# Altium schematic sheet 10 ARDUINO_JTAG.SchDoc
size 513 x 386 mm
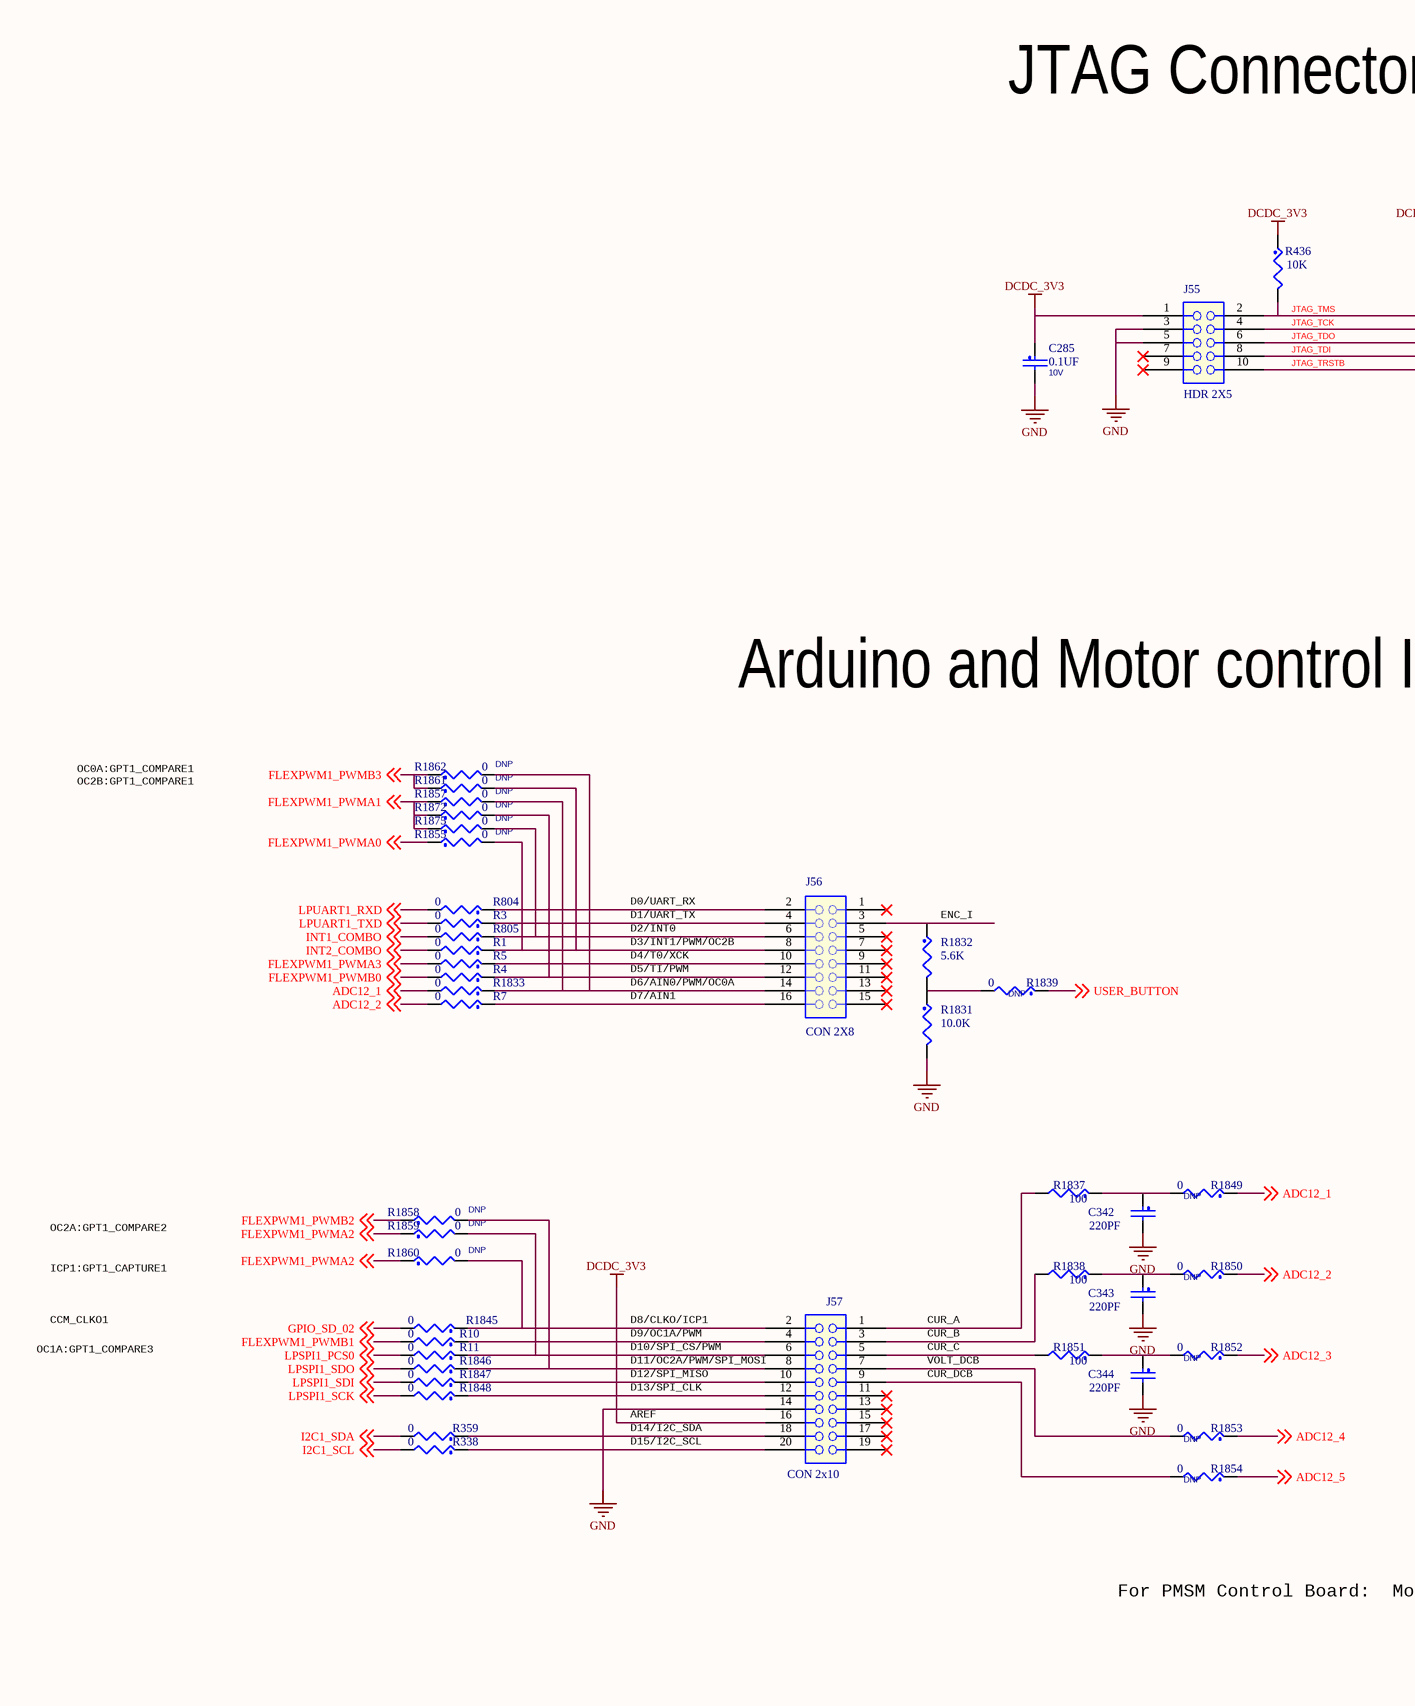
[diagram p0: 10 ARDUINO_JTAG.SchDoc, left]
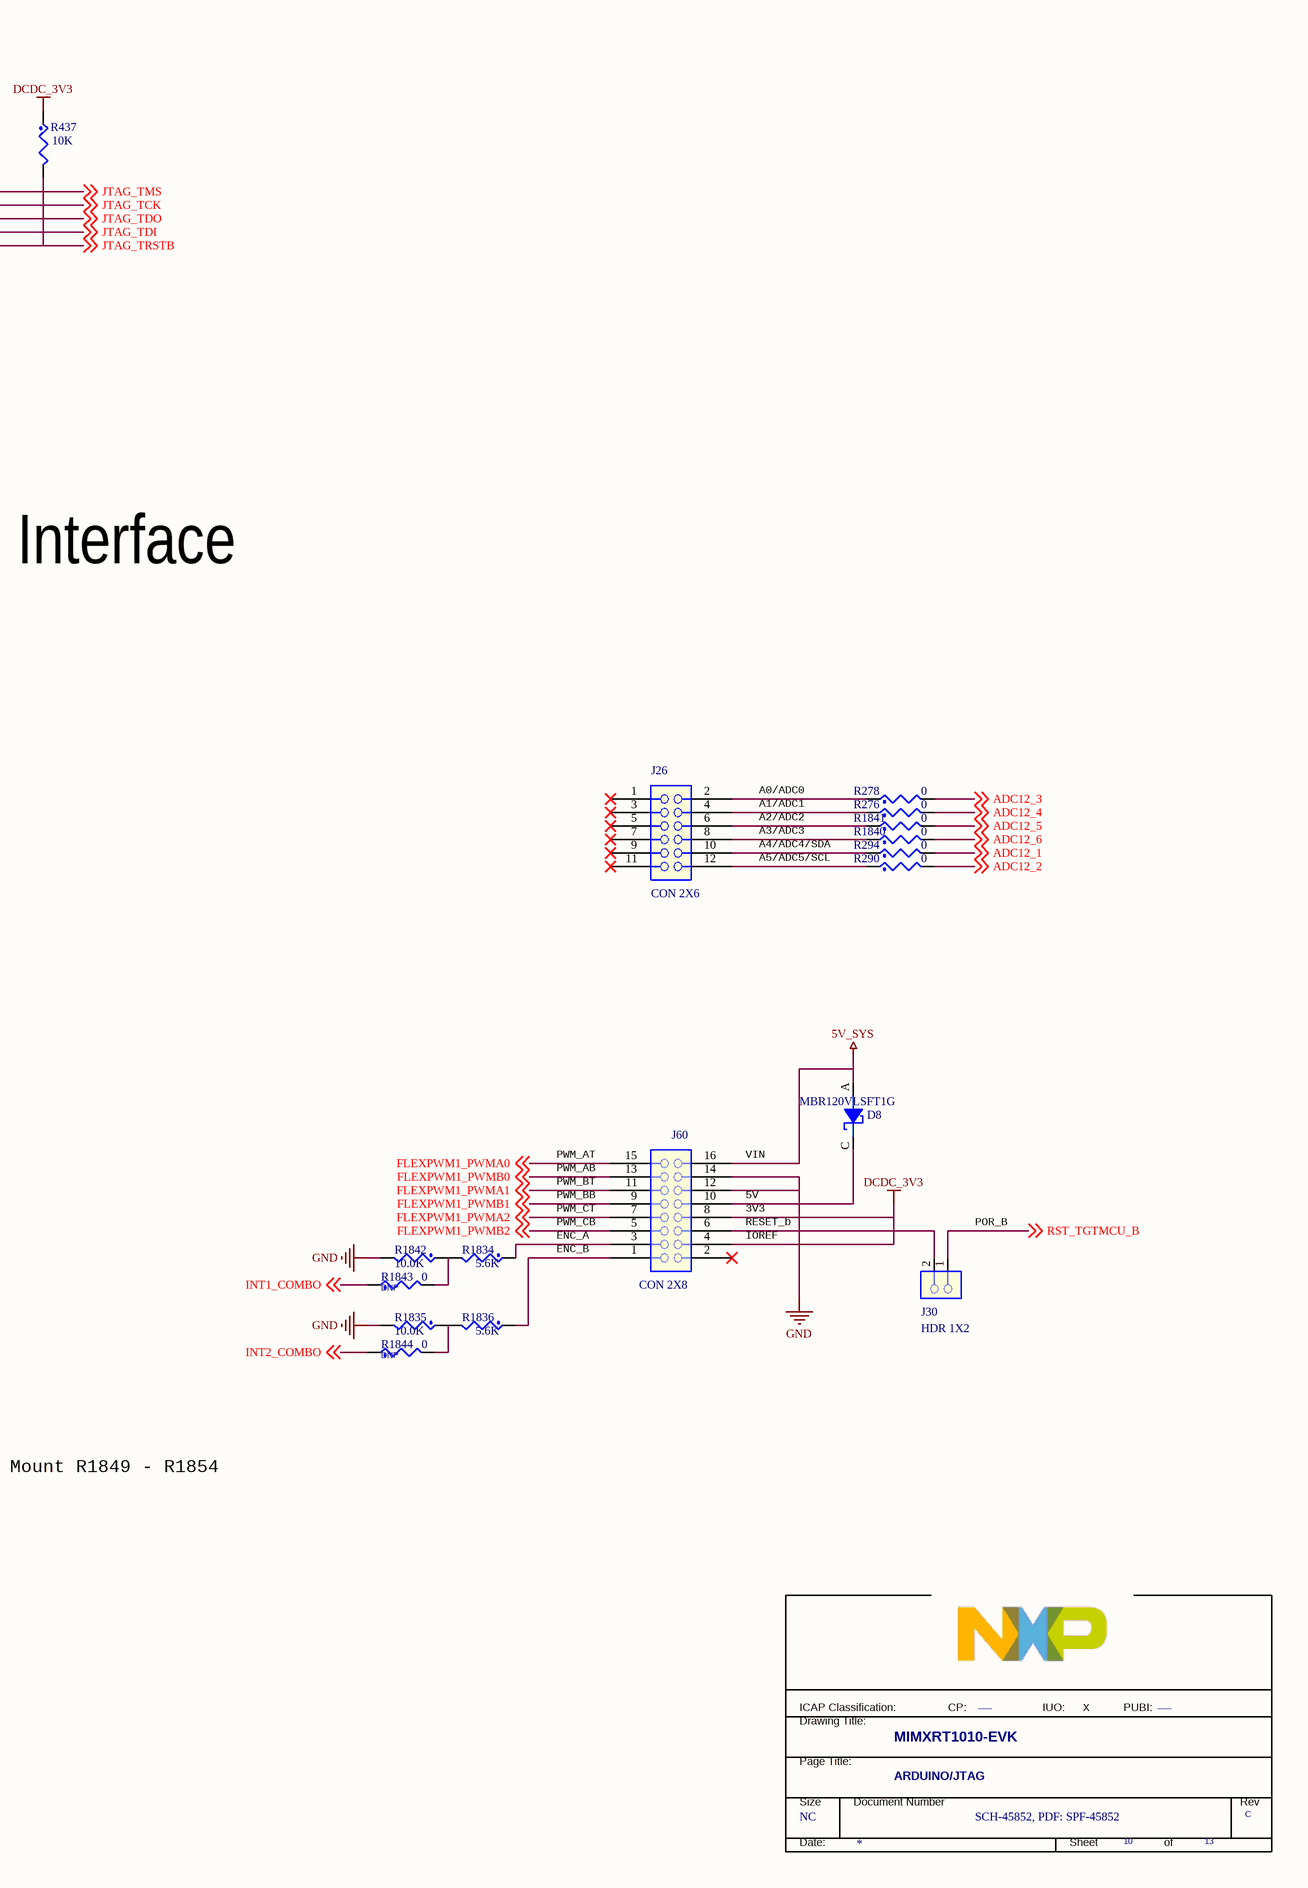
[diagram p1: 10 ARDUINO_JTAG.SchDoc, right]

## Parts
*  PUBI: ___  Doc: SCH-45852, PDF: SPF-45852  RevCode: C  Title: MIMXRT1010-EVK  Page Size: NC  Page Number: 10  Page Count: 13  PageTitle: ARDUINO/JTAG  (hidden comment: TitleBlock_FS)  (graphical)
C285  0.1UF  VOLTAGE: 10V  [CC0402_25]
C342  220PF  [CC0402_25]
C343  220PF  [CC0402_25]
C344  220PF  [CC0402_25]
D8  MBR120VLSFT1G  [SOD-123]
J26  CON 2X6  [con_skt2x6_th]
J30  HDR 1X2  [HDR102]
J55  HDR 2X5  [hdr205_50_th]
J56  CON 2X8  [con_2x8_skt_100_th]
J57  CON 2x10  [con_skt2x10_th]
J60  CON 2X8  [con_2x8_skt_100_th]
R1  0  [0402_CC]
R3  0  [0402_CC]
R4  0  [0402_CC]
R5  0  [0402_CC]
R7  0  [0402_CC]
R10  0  [0402_CC]
R11  0  [0402_CC]
R276  0  [0402_CC]
R278  0  [0402_CC]
R290  0  [0402_CC]
R294  0  [0402_CC]
R338  0  [0402_CC]
R359  0  [0402_CC]
R436  10K  [0402_CC]
R437  10K  [0402_CC]
R804  0  [0402_CC]
R805  0  [0402_CC]
R1831  10.0K  [RC0402_25]
R1832  5.6K  [RC0402_25]
R1833  0  [0402_CC]
R1834  5.6K  [RC0402_25]
R1835  10.0K  [RC0402_25]
R1836  5.6K  [RC0402_25]
R1837  100  [RC0402_25]
R1838  100  [RC0402_25]
R1839  0  ASSY_OPT: DNP  [0402_CC]
R1840  0  [0402_CC]
R1841  0  [0402_CC]
R1842  10.0K  [RC0402_25]
R1843  0  ASSY_OPT: DNP  [0402_CC]
R1844  0  ASSY_OPT: DNP  [0402_CC]
R1845  0  [0402_CC]
R1846  0  [0402_CC]
R1847  0  [0402_CC]
R1848  0  [0402_CC]
R1849  0  ASSY_OPT: DNP  [0402_CC]
R1850  0  ASSY_OPT: DNP  [0402_CC]
R1851  100  [RC0402_25]
R1852  0  ASSY_OPT: DNP  [0402_CC]
R1853  0  ASSY_OPT: DNP  [0402_CC]
R1854  0  ASSY_OPT: DNP  [0402_CC]
R1855  0  ASSY_OPT: DNP  [0402_CC]
R1857  0  ASSY_OPT: DNP  [0402_CC]
R1858  0  ASSY_OPT: DNP  [0402_CC]
R1859  0  ASSY_OPT: DNP  [0402_CC]
R1860  0  ASSY_OPT: DNP  [0402_CC]
R1861  0  ASSY_OPT: DNP  [0402_CC]
R1862  0  ASSY_OPT: DNP  [0402_CC]
R1872  0  ASSY_OPT: DNP  [0402_CC]
R1875  0  ASSY_OPT: DNP  [0402_CC]

## Nets
5V_SYS: D8.A J60.16(B8)
DCDC_3V3: C285.1 J55.1(A1) J57.16 J60.4(B2) J60.8(B4) R436.1 R437.1
GND: C285.2 C342.2 C343.2 C344.2 J55.3(A2) J55.5(A3) J57.14 J60.12(B6) J60.14(B7) R1831.2 R1835.2 R1842.2
ADC12_1: R294.2 R1833.2 R1849.1 ; off-sheet ADC12_1
ADC12_2: R7.2 R290.2 R1850.1 ; off-sheet ADC12_2
ADC12_3: R278.2 R1852.1 ; off-sheet ADC12_3
ADC12_4: R276.2 R1853.1 ; off-sheet ADC12_4
ADC12_5: R1841.2 R1854.1 ; off-sheet ADC12_5
ADC12_6: R1840.2 ; off-sheet ADC12_6
FLEXPWM1_PWMA0: J60.15(A8) R1855.1 ; off-sheet FLEXPWM1_PWMA0
FLEXPWM1_PWMA1: J60.11(A6) R1857.1 R1872.1 R1875.1 ; off-sheet FLEXPWM1_PWMA1
FLEXPWM1_PWMA2: J60.7(A4) R1859.1 R1860.1 ; off-sheet FLEXPWM1_PWMA2
FLEXPWM1_PWMA3: R5.2 ; off-sheet FLEXPWM1_PWMA3
FLEXPWM1_PWMB0: J60.13(A7) R4.2 ; off-sheet FLEXPWM1_PWMB0
FLEXPWM1_PWMB1: J60.9(A5) R10.2 ; off-sheet FLEXPWM1_PWMB1
FLEXPWM1_PWMB2: J60.5(A3) R1858.1 ; off-sheet FLEXPWM1_PWMB2
FLEXPWM1_PWMB3: R1861.1 R1862.1 ; off-sheet FLEXPWM1_PWMB3
GPIO_SD_02: R1845.2 ; off-sheet GPIO_SD_02
I2C1_SCL: R338.2 ; off-sheet I2C1_SCL
I2C1_SDA: R359.2 ; off-sheet I2C1_SDA
INT1_COMBO: R805.2 R1843.1 ; off-sheet INT1_COMBO
INT2_COMBO: R1.2 R1844.1 ; off-sheet INT2_COMBO
JTAG_TCK: J55.4(B2) ; off-sheet JTAG_TCK
JTAG_TDI: J55.8(B4) ; off-sheet JTAG_TDI
JTAG_TDO: J55.6(B3) ; off-sheet JTAG_TDO
JTAG_TMS: J55.2(B1) R436.2 ; off-sheet JTAG_TMS
JTAG_TRSTB: J55.10(B5) R437.2 ; off-sheet JTAG_TRSTB
LPSPI1_PCS0: R11.2 ; off-sheet LPSPI1_PCS0
LPSPI1_SCK: R1848.2 ; off-sheet LPSPI1_SCK
LPSPI1_SDI: R1847.2 ; off-sheet LPSPI1_SDI
LPSPI1_SDO: R1846.2 ; off-sheet LPSPI1_SDO
LPUART1_RXD: R804.2 ; off-sheet LPUART1_RXD
LPUART1_TXD: R3.2 ; off-sheet LPUART1_TXD
RST_TGTMCU_B: J30.1 ; off-sheet RST_TGTMCU_B
USER_BUTTON: R1839.1 ; off-sheet USER_BUTTON
NetC342_1: C342.1 R1837.1 R1849.2
NetC343_1: C343.1 R1838.1 R1850.2
NetC344_1: C344.1 R1851.1 R1852.2
NetD8_C: D8.C J60.10(B5)
NetJ26_2: J26.2(B1) R278.1
NetJ26_4: J26.4(B2) R276.1
NetJ26_6: J26.6(B3) R1841.1
NetJ26_8: J26.8(B4) R1840.1
NetJ26_10: J26.10(B5) R294.1
NetJ26_12: J26.12(B6) R290.1
NetJ30_2: J30.2 J60.6(B3)
NetJ56_2: J56.2(B1) R804.1
NetJ56_3: J56.3(A2) R1832.1
NetJ56_4: J56.4(B2) R3.1
NetJ56_6: J56.6(B3) R805.1 R1875.2
NetJ56_8: J56.8(B4) R1.1 R1855.2 R1861.2
NetJ56_10: J56.10(B5) R5.1
NetJ56_12: J56.12(B6) R4.1 R1872.2
NetJ56_14: J56.14(B7) R1833.1 R1857.2 R1862.2
NetJ56_16: J56.16(B8) R7.1
NetJ57_1: J57.1 R1837.2
NetJ57_2: J57.2 R1845.1 R1860.2
NetJ57_3: J57.3 R1838.2
NetJ57_4: J57.4 R10.1
NetJ57_5: J57.5 R1851.2
NetJ57_6: J57.6 R11.1 R1859.2
NetJ57_7: J57.7 R1853.2
NetJ57_8: J57.8 R1846.1 R1858.2
NetJ57_9: J57.9 R1854.2
NetJ57_10: J57.10 R1847.1
NetJ57_12: J57.12 R1848.1
NetJ57_18: J57.18 R359.1
NetJ57_20: J57.20 R338.1
NetJ60_1: J60.1(A1) R1836.1
NetJ60_3: J60.3(A2) R1834.1
NetR1831_1: R1831.1 R1832.2 R1839.2
NetR1834_2: R1834.2 R1842.1 R1843.2
NetR1835_1: R1835.1 R1836.2 R1844.2

Not connected (* = marked no-connect by the designer): J26 1(A1)* 3(A2)* 5(A3)* 7(A4)* 9(A5)* 11(A6)*; J55 7(A4)* 9(A5)*; J56 1(A1)* 5(A3)* 7(A4)* 9(A5)* 11(A6)* 13(A7)* 15(A8)*; J57 11* 13* 15* 17* 19*; J60 2(B1)*

## Notes on the sheet
- JTAG Connector
- Arduino and Motor control Interface
- OC0A:GPT1_COMPARE1
  OC2B:GPT1_COMPARE1
- D1/UART_TX
- D2/INT0
- D0/UART_RX
- (near R1832) ENC_I
- A0/ADC0
- A1/ADC1
- D7/AIN1
- D4/T0/XCK
- D5/TI/PWM
- D6/AIN0/PWM/OC0A
- D3/INT1/PWM/OC2B
- A3/ADC3
- A2/ADC2
- A4/ADC4/SDA
- A5/ADC5/SCL
- OC2A:GPT1_COMPARE2
- ICP1:GPT1_CAPTURE1
- OC1A:GPT1_COMPARE3
- CCM_CLKO1
- D8/CLKO/ICP1
- D9/OC1A/PWM
- CUR_B
- CUR_A
- PWM_AT
- PWM_AB
- PWM_CT
- PWM_BT
- PWM_BB
- 3V3
- 5V
- VIN
- D10/SPI_CS/PWM
- D12/SPI_MISO
- D11/OC2A/PWM/SPI_MOSI
- D13/SPI_CLK
- CUR_C
- CUR_DCB
- VOLT_DCB
- ENC_A
- ENC_B
- PWM_CB
- RESET_b
- IOREF
- (near J30) POR_B
- D15/I2C_SCL
- D14/I2C_SDA
- AREF
- For PMSM Control Board:  Mount R1849 - R1854
- X
- (in symbol TitleBlock_FS) ICAP Classification:; CP:; IUO:; PUBI:; Drawing Title:; Page Title:; Size; Document Number; Rev; Date:; Sheet; of

## Library data of the parts
* = TitleBlock_FS: FIUO: _X_; OrgAddr2: Austin, TX 78735-8598; OrgAddr1: 6501 William Cannon Drive West; OrgName: Freescale Semiconductor; FCP: ___; Page Create Date: March  8, 1995; Page Modify Date: *
C285 = CAP_NP: CAP CER 0.1UF 10V 10% X5R 0402; CLASS: DISCRETE; FPLIST: CC0402_25,CC0402_HD,0402_CC; CAD_APPROVED: Yes; MFG_PN01: CC0402KRX5R6BB104; MFG_NAME01: YAGEO AMERICA; AGILE_PN: 150-75634; PCB Footprint: CC0402_25; HEIGHT: 0.64MM; ROHS: Yes; Tolerance: 10%
C342-C344 = CAP_NP: CAP CER 220PF 50V 10% X7R 0402; CLASS: DISCRETE; AGILE_PN: 150-75829; MFG_NAME01: KEMET; MFG_PN01: C0402C221K5RAC; CAD_APPROVED: Yes; FPLIST: CC0402_25,CC0402_HD,0402_CC; Tolerance: 10%; ROHS: Yes; HEIGHT: 0.55MM; VOLTAGE: 50V; PCB Footprint: CC0402_25
D8 = DIODE_SCHTKY_Dup1: DIODE SCH RECT 1A 20V SMT; CLASS: IC; AGILE_PN: 480-75997; MFG_NAME01: ON SEMICONDUCTOR; CAD_APPROVED: Yes; MFG_PN01: MBR120VLSFT1G; ROHS: Yes; HEIGHT: 1MM; PCB Footprint: SOD-123
J26 = CONN_HDR_6X2: CON 2X6 SKT SHRD TH 100MIL CTR 345H AU 126L; CLASS: IO; AGILE_PN: 210-81774; MFG_NAME01: ANYTRONIC CORPORATION LIMITED; MFG_PN01: 08010S31211-29RF; Temp_Range: -40 to +105C; CAD_APPROVED: Yes; PCB Footprint: con_skt2x6_th; ROHS: Yes; HEIGHT: 8.75MM
J30 = CONN_HDR_2X1: HDR 1X2 TH 100MIL SP 339H AU 98L; CLASS: IO; AGILE_PN: 210-81490; MFG_NAME01: ANYTRONIC CORPORATION LIMITED; MFG_PN01: 0901S0202011N9T-31RF; Temp_Range: -55¡ãC to +105¡ãC; CAD_APPROVED: Yes; ROHS: Yes; HEIGHT: 8.59MM; PCB Footprint: HDR102
J55 = CONN_HDR_5X2: HDR 2X5 TH 50MIL CTR 172H AU 91L; CLASS: IO; AGILE_PN: 210-81466; MFG_NAME01: ANYTRONIC CORPORATION LIMITED; MFG_PN01: 0922S0205011N9T-31RF; Temp_Range: -55DegC to +105DegC; CAD_APPROVED: Yes; PCB Footprint: hdr205_50_th; ROHS: Yes; HEIGHT: 4.38MM
J56 J60 = CONN_HDR_8X2: CON 2X8 SKT SHRD TH 100MIL CTR 345H AU 126L; CLASS: IO; AGILE_PN: 210-81775; MFG_NAME01: ANYTRONIC CORPORATION LIMITED; MFG_PN01: 08010S31611-29RF; Temp_Range: -40 to +105C; CAD_APPROVED: Yes; PCB Footprint: con_2x8_skt_100_th; ROHS: Yes; HEIGHT: 8.75MM
J57 = CONN_HDR_10X2: CON 2X10 SKT SHRD TH 100MIL CTR 345H AU 126L; CLASS: IO; CAD_APPROVED: Yes; Temp_Range: -40 to +105C; MFG_PN01: 08010S32011-29RF; MFG_NAME01: ANYTRONIC CORPORATION LIMITED; AGILE_PN: 210-81776; PCB Footprint: con_skt2x10_th; HEIGHT: 8.75MM; ROHS: Yes
R1 R4 R5 R7 R11 R294 R359 R1833 R1839 R1841 R1845 R1847 R1854 R1855 R1857-R1859 R1861 R1872 R1875 = RES_Dup1: RES MF ZERO OHM 1/16W 5% 0402; CLASS: DISCRETE; FPLIST: RC0402_25,RC0402_HD,RC0402_X2,0402_CC; CAD_APPROVED: Yes; MFG_PN01: MCR01MZPJ000; MFG_NAME01: ROHM; AGILE_PN: 470-75394; PCB Footprint: 0402_CC; ROHS: Yes; Tolerance: 5%; HEIGHT: 0.45 MM
R3 R10 R276 R278 R290 R338 R804 R805 R1840 R1843 R1844 R1846 R1848-R1850 R1852 R1853 R1860 R1862 = RES_Dup1: RES MF ZERO OHM 1/16W 5% 0402; CLASS: DISCRETE; AGILE_PN: 470-75394; MFG_NAME01: ROHM; MFG_PN01: MCR01MZPJ000; CAD_APPROVED: Yes; FPLIST: RC0402_25,RC0402_HD,RC0402_X2,0402_CC; PCB Footprint: 0402_CC; HEIGHT: 0.45 MM; Tolerance: 5%; ROHS: Yes
R436 R437 = RES_Dup1: RES MF 10K 1/16W 5% 0402; CLASS: DISCRETE; AGILE_PN: 470-75557; MFG_NAME01: VISHAY INTERTECHNOLOGY; MFG_PN01: CRCW040210K0JNED; CAD_APPROVED: Yes; FPLIST: RC0402_25,RC0402_HD,0402_CC; PCB Footprint: 0402_CC; HEIGHT: 0.4 MM; TOL: 5%; Tolerance: 5%; ROHS: Yes
R1831 R1835 = RES_Dup1: RES MF 10.0K 1/16W 1% 0402; CLASS: DISCRETE; FPLIST: RC0402_25,RC0402_HD,0402_CC; CAD_APPROVED: Yes; MFG_PN01: WR04X1002FTL; MFG_NAME01: WALSIN TECHNOLOGY CORP.; AGILE_PN: 470-80574; PCB Footprint: RC0402_25; HEIGHT: 0.4MM; ROHS: Yes; Tolerance: 1%
R1832 R1836 = RES_Dup1: RES MF 5.6K  1/16W 1% 0402; CLASS: DISCRETE; AGILE_PN: 470-30919; MFG_NAME01: YAGEO AMERICA; MFG_PN01: RC0402FR-075K6L; Temp_Range: -55¡ãC ~ 155¡ãC; CAD_APPROVED: Yes; FPLIST: RC0402_25,RC0402_HD,0402_CC; PCB Footprint: RC0402_25; Tolerance: 1%; ROHS: Yes; HEIGHT: 0.40 MM
R1834 = RES_Dup1: RES MF 5.6K  1/16W 1% 0402; CLASS: DISCRETE; FPLIST: RC0402_25,RC0402_HD,0402_CC; CAD_APPROVED: Yes; Temp_Range: -55¡ãC ~ 155¡ãC; MFG_PN01: RC0402FR-075K6L; MFG_NAME01: YAGEO AMERICA; AGILE_PN: 470-30919; HEIGHT: 0.40 MM; ROHS: Yes; Tolerance: 1%; PCB Footprint: RC0402_25
R1837 R1838 R1851 = RES_Dup1: RES MF 100 OHM 1/16W 5% 0402; CLASS: DISCRETE; FPLIST: RC0402_25,RC0402_HD,RC0402_X2,0402_CC; CAD_APPROVED: Yes; MFG_PN01: NRCL04J101TRF; MFG_NAME01: NIC COMPONENTS CORP; AGILE_PN: 470-75591; HEIGHT: 0.45mm; ROHS: Yes; Tolerance: 5%; PCB Footprint: RC0402_25
R1842 = RES_Dup1: RES MF 10.0K 1/16W 1% 0402; CLASS: DISCRETE; AGILE_PN: 470-80574; MFG_NAME01: WALSIN TECHNOLOGY CORP.; MFG_PN01: WR04X1002FTL; CAD_APPROVED: Yes; FPLIST: RC0402_25,RC0402_HD,0402_CC; Tolerance: 1%; ROHS: Yes; HEIGHT: 0.4MM; PCB Footprint: RC0402_25